# EAGLE design mainBoard (EAGLE 7.6.0)
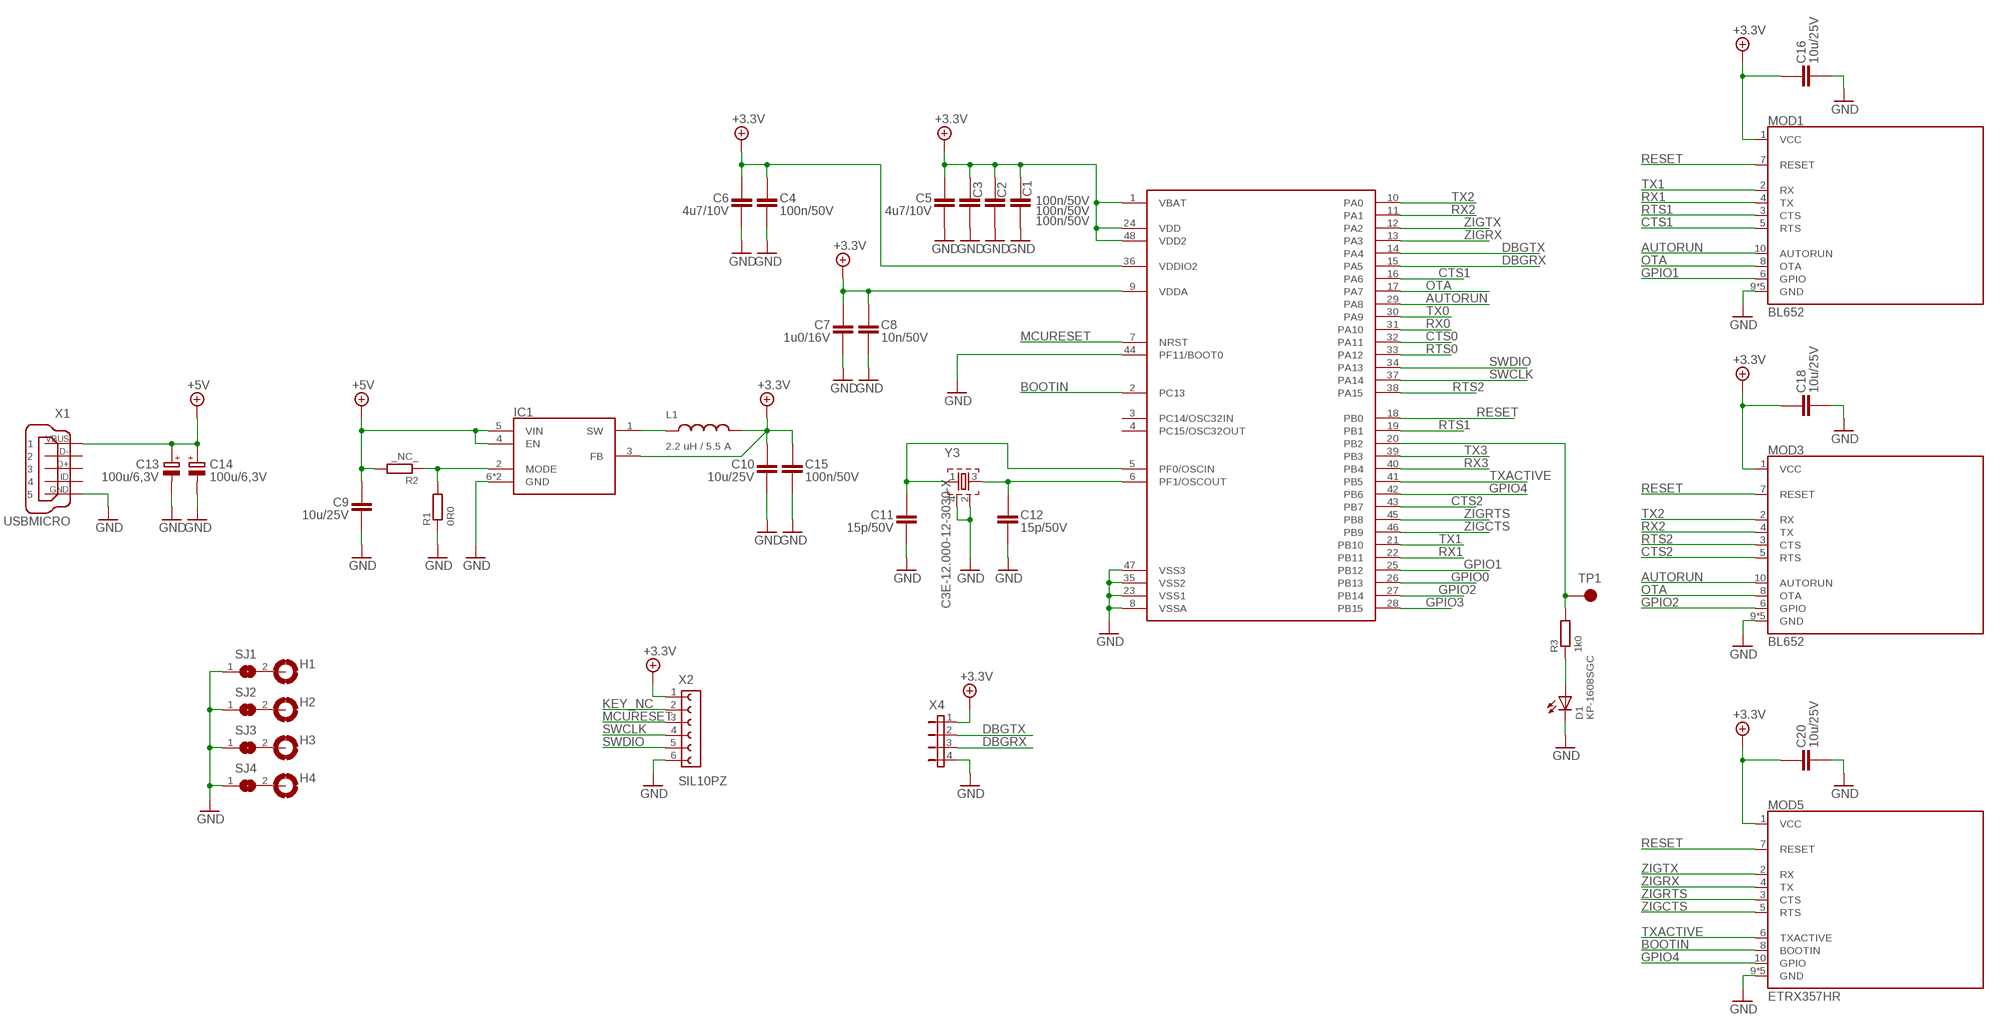
[diagram p0: schematic, sheet 1, part 1 of 2]
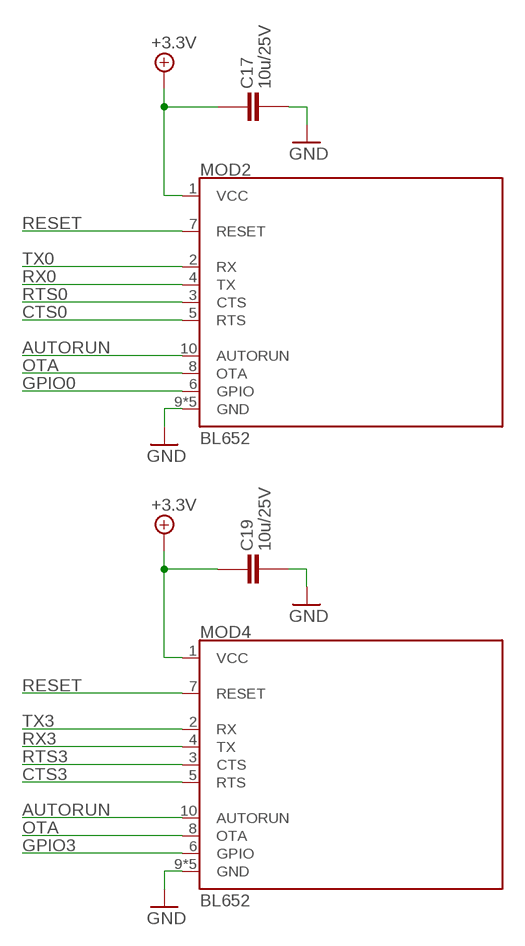
[diagram p1: schematic, sheet 1, part 2 of 2]

## Parts
C1  100N/50V,X7R,+/-10%_0603R  [C0603R]
C2  100N/50V,X7R,+/-10%_0603R  [C0603R]
C3  100N/50V,X7R,+/-10%_0603R  [C0603R]
C4  100N/50V,X7R,+/-10%_0603R  [C0603R]
C5  4U7/10V,X5R,+/-10%_0603R  [C0603R]
C6  4U7/10V,X5R,+/-10%_0603R  [C0603R]
C7  1U0/16V,X5R,+/-10%_0603R  [C0603R]
C8  10N/50V,X7R,+/-10%_0603R  [C0603R]
C9  10U/25V,X5R,+/-10%_0805R  [C0805R]
C10  10U/25V,X5R,+/-10%_0805R  [C0805R]
C11  15P/50V,COG/NPO,+/-5%_0603R  [C0603R]
C12  15P/50V,COG/NPO,+/-5%_0603R  [C0603R]
C13  100U  [CT6032]
C14  100U  [CT6032]
C15  100N/50V,X7R,+/-10%_0603R  [C0603R]
C16  10U/25V,X5R,+/-10%_0805R  [C0805R]
C17  10U/25V,X5R,+/-10%_0805R  [C0805R]
C18  10U/25V,X5R,+/-10%_0805R  [C0805R]
C19  10U/25V,X5R,+/-10%_0805R  [C0805R]
C20  10U/25V,X5R,+/-10%_0805R  [C0805R]
D1  KP-1608SGC  [0603]
H1  MOUNT-PAD-ROUND4.3  [4.3-PAD]
H2  MOUNT-PAD-ROUND4.3  [4.3-PAD]
H3  MOUNT-PAD-ROUND4.3  [4.3-PAD]
H4  MOUNT-PAD-ROUND4.3  [4.3-PAD]
IC0  STM32F091CCT  [LQFP48]
IC1  TPS62291  [TPS62291]
L1  2U2_IHLP2020  [5.49X2X5.18MM]
MOD1  BLEMODULE  [BLEMOD]
MOD2  BLEMODULE  [BLEMOD]
MOD3  BLEMODULE  [BLEMOD]
MOD4  BLEMODULE  [BLEMOD]
MOD5  ZIGBEE  [ZIGBEEMOD]
R1  0R0/0.1W,THICK_FILM,1%_0603R  [R0603R]
R2  _NC_/0.1W,THICK_FILM,1%_0603R  [R0603R]
R3  1K0/0.1W,THICK_FILM,1%_0603R  [R0603R]
SJ1  SJ_1-SMALL  [SJ-SMALL]
SJ2  SJ_1-SMALL  [SJ-SMALL]
SJ3  SJ_1-SMALL  [SJ-SMALL]
SJ4  SJ_1-SMALL  [SJ-SMALL]
TP1  TEST-PAD_3.5X2-SMD  [3.5X2_SMD]
X1  USBMICRO  [USBMICRO]
X2  SOCKET_HADER-1X6  [1X06]
X4  PIN_HEADER-1X4  [1X04]
Y3  C3E-12.000-12-3030-X  [3.4X2.7X0.75]

## Nets
+3.3V: C1.2 C2.2 C3.2 C4.2 C5.2 C6.2 C7.2 C8.2 C10.2 C15.2 C16.2 C17.2 C18.2 C19.2 C20.2 IC0.1(VBAT) IC0.9(VDDA) IC0.24(VDD) IC0.36(VDDIO2) IC0.48(VDD2) IC1.3(FB) L1.P$2 MOD1.1(VCC) MOD2.1(VCC) MOD3.1(VCC) MOD4.1(VCC) MOD5.1(VCC) X2.1 X4.1
+5V: C9.2 C13.+ C14.+ IC1.4(EN) IC1.5(VIN) R2.2 X1.1
AUTORUN: IC0.29(PA8) MOD1.10(AUTORUN) MOD2.10(AUTORUN) MOD3.10(AUTORUN) MOD4.10(AUTORUN)
BOOTIN: IC0.2(PC13) MOD5.8(BOOTIN)
CTS0: IC0.32(PA11) MOD2.5(RTS)
CTS1: IC0.16(PA6) MOD1.5(RTS)
CTS2: IC0.43(PB7) MOD3.5(RTS)
CTS3: MOD4.5(RTS)
DBGRX: IC0.15(PA5) X4.3
DBGTX: IC0.14(PA4) X4.2
GND: C1.1 C2.1 C3.1 C4.1 C5.1 C6.1 C7.1 C8.1 C9.1 C10.1 C11.1 C12.1 C13.- C14.- C15.1 C16.1 C17.1 C18.1 C19.1 C20.1 D1.2(C) IC0.8(VSSA) IC0.23(VSS1) IC0.35(VSS2) IC0.44(PF11/BOOT0) IC0.47(VSS3) IC1.6(GND) IC1.EXP(GND) MOD1.9(GND) MOD1.A1(GND) MOD1.A2(GND) MOD1.B1(GND) MOD1.B2(GND) MOD2.9(GND) MOD2.A1(GND) MOD2.A2(GND) MOD2.B1(GND) MOD2.B2(GND) MOD3.9(GND) MOD3.A1(GND) MOD3.A2(GND) MOD3.B1(GND) MOD3.B2(GND) MOD4.9(GND) MOD4.A1(GND) MOD4.A2(GND) MOD4.B1(GND) MOD4.B2(GND) MOD5.9(GND) MOD5.A1(GND) MOD5.A2(GND) MOD5.B1(GND) MOD5.B2(GND) R1.1 SJ1.1 SJ2.1 SJ3.1 SJ4.1 X1.5 X1.H1 X1.H2 X2.6 X4.4 Y3.2 Y3.4
GPIO0: IC0.26(PB13) MOD2.6(GPIO)
GPIO1: IC0.25(PB12) MOD1.6(GPIO)
GPIO2: IC0.27(PB14) MOD3.6(GPIO)
GPIO3: IC0.28(PB15) MOD4.6(GPIO)
GPIO4: IC0.42(PB6) MOD5.10(GPIO)
KEY_NC: X2.2
MCURESET: IC0.7(NRST) X2.3
N$1: IC1.1(SW) L1.P$1
N$2: D1.1(A) R3.1
N$3: IC0.20(PB2) R3.2 TP1.TP
N$4: IC1.2(MODE) R1.2 R2.1
N$5: H1.1(MOUNT) SJ1.2
N$6: H2.1(MOUNT) SJ2.2
N$7: H3.1(MOUNT) SJ3.2
N$8: H4.1(MOUNT) SJ4.2
N$34: C11.2 IC0.5(PF0/OSCIN) Y3.1
N$35: C12.2 IC0.6(PF1/OSCOUT) Y3.3
OTA: IC0.17(PA7) MOD1.8(OTA) MOD2.8(OTA) MOD3.8(OTA) MOD4.8(OTA)
RESET: IC0.18(PB0) MOD1.7(RESET) MOD2.7(RESET) MOD3.7(RESET) MOD4.7(RESET) MOD5.7(RESET)
RTS0: IC0.33(PA12) MOD2.3(CTS)
RTS1: IC0.19(PB1) MOD1.3(CTS)
RTS2: IC0.38(PA15) MOD3.3(CTS)
RTS3: MOD4.3(CTS)
RX0: IC0.31(PA10) MOD2.4(TX)
RX1: IC0.22(PB11) MOD1.4(TX)
RX2: IC0.11(PA1) MOD3.4(TX)
RX3: IC0.40(PB4) MOD4.4(TX)
SWCLK: IC0.37(PA14) X2.4
SWDIO: IC0.34(PA13) X2.5
TX0: IC0.30(PA9) MOD2.2(RX)
TX1: IC0.21(PB10) MOD1.2(RX)
TX2: IC0.10(PA0) MOD3.2(RX)
TX3: IC0.39(PB3) MOD4.2(RX)
TXACTIVE: IC0.41(PB5) MOD5.6(TXACTIVE)
ZIGCTS: IC0.46(PB9) MOD5.5(RTS)
ZIGRTS: IC0.45(PB8) MOD5.3(CTS)
ZIGRX: IC0.13(PA3) MOD5.4(TX)
ZIGTX: IC0.12(PA2) MOD5.2(RX)
Unconnected: IC0.3(PC14/OSC32IN) IC0.4(PC15/OSC32OUT) X1.2 X1.3 X1.4

## Library data of the parts
C1-C4 C15 = 0-LIB_Capacitor_ceramic:100N; COMPONENT_PACKAGE: 0603; COMPONENT_TITLE: Capacitor ceramic; COMPONENT_VALUE: 100n/50V; LIB: ECAP-000019; LIB_REEL: ECAP-000129; NOTE: X7R, +/-10%
C5 C6 = 0-LIB_Capacitor_ceramic:4U7; COMPONENT_PACKAGE: 0603; COMPONENT_TITLE: Capacitor ceramic; COMPONENT_VALUE: 4u7/10V; LIB: ECAP-000044; NOTE: X5R, +/-10%
C7 = 0-LIB_Capacitor_ceramic:1U0; COMPONENT_PACKAGE: 0603; COMPONENT_TITLE: Capacitor ceramic; COMPONENT_VALUE: 1u0/16V; LIB: ECAP-000027; NOTE: X5R, +/-10%
C8 = 0-LIB_Capacitor_ceramic:10N; COMPONENT_PACKAGE: 0603; COMPONENT_TITLE: Capacitor ceramic; COMPONENT_VALUE: 10n/50V; LIB: ECAP-000021; LIB_REEL: ECAP-000127; NOTE: X7R, +/-10%
C9 C10 C16-C20 = 0-LIB_Capacitor_ceramic:10U; COMPONENT_PACKAGE: 0805; COMPONENT_TITLE: Capacitor ceramic; COMPONENT_VALUE: 10u/25V; LIB: ECAP-000112; LIB_REEL: ECAP-000143; NOTE: X5R, +/-10%
C11 C12 = 0-LIB_Capacitor_ceramic:15P; COMPONENT_PACKAGE: 0603; COMPONENT_TITLE: Capacitor ceramic; COMPONENT_VALUE: 15p/50V; LIB: ECAP-000023; NOTE: COG/NPO, +/-5%
C13 C14 = 0-LIB_Capacitor_tantalum:100U; COMPONENT_MANUFACTURER: Kemet; COMPONENT_PACKAGE: 6032 metric, C; COMPONENT_TITLE: Capacitor Tantalum; COMPONENT_VALUE: 100u/6,3V; LIB: ECAP-000236; NOTE: LOW ESR
D1 = 0-LIB_LED:KP-1608?; COMPONENT_MANUFACTURER: Kingbright; COMPONENT_PACKAGE: 0603; COMPONENT_TITLE: LED Diode; COMPONENT_VALUE: KP-1608SGC; FARNELL: 8529833; LIB: ELED-000003; NOTE: Green
H1-H4 = 0-LIB_Accesories_PCB:MOUNT-PAD-ROUND: MOUNTING PAD, round; DISPLAY_DEVICE: NO
IC0 = lib:STM32F091CCT
IC1 = lib:TPS62291
L1 = 0-LIB_Inductor:2U2; COMPONENT_MANUFACTURER: Vishay/Dale; COMPONENT_PACKAGE: 5,49x2x5,18mm; COMPONENT_TITLE: Inductor; COMPONENT_VALUE: 2.2 uH / 5.5 A; LIB: EIND-000039; NOTE: IHLP2020BZER2R2M11
MOD1-MOD4 = boards:BLEMODULE; COMPONENT_VALUE: BL652
MOD5 = boards:ZIGBEE; COMPONENT_VALUE: ETRX357HR
R1 = 0-LIB_Resistor:0R0; COMPONENT_PACKAGE: 0603; COMPONENT_TITLE: Resistor; COMPONENT_VALUE: 0R0; LIB: ERES-000024; LIB_REEL: ERES-000194; NOTE: 0.1W, Thick_Film, 1%
R2 = 0-LIB_Resistor:_NC_; COMPONENT_PACKAGE: 0603; COMPONENT_TITLE: Resistor; COMPONENT_VALUE: _NC_; DISPLAY_DEVICE: NO; NOTE: 0.1W, Thick_Film, 1%
R3 = 0-LIB_Resistor:1K0; COMPONENT_PACKAGE: 0603; COMPONENT_TITLE: Resistor; COMPONENT_VALUE: 1k0; LIB: ERES-000036; LIB_REEL: ERES-000200; NOTE: 0.1W, Thick_Film, 1%
SJ1-SJ4 = 0-LIB_Accesories_PCB:SJ_1?; DISPLAY_DEVICE: NO
TP1 = 0-LIB_Accesories_PCB:TEST-PAD; DISPLAY_DEVICE: NO
X1 = lib:USBMICRO
X2 = 0-LIB_Connectors_Board-to-Board:SOCKET_HADER-1X6; COMPONENT_MANUFACTURER: XINYA; COMPONENT_PACKAGE: 2.54mm; 1x6sockets; COMPONENT_TITLE: Connector - Socket Header; COMPONENT_VALUE: SIL10PZ; GMD: 824-019; LIB: ECON-000012
X4 = 0-LIB_Connectors_Board-to-Board:PIN_HEADER-1X4; COMPONENT_PACKAGE: 2.54mm; 1x4pins; COMPONENT_TITLE: Connector - Pin Header; LIB: ECON-000376
Y3 = 0-LIB_Crystal:C3E-12.000-12-3030-X; COMPONENT_MANUFACTURER: AKER; COMPONENT_PACKAGE: 3.4 x 2.7mm; COMPONENT_TITLE: Crystal; COMPONENT_VALUE: C3E-12.000-12-3030-X; FARNELL: 1538852; LIB: EOSC-000011; NOTE: 12Mhz

## Board
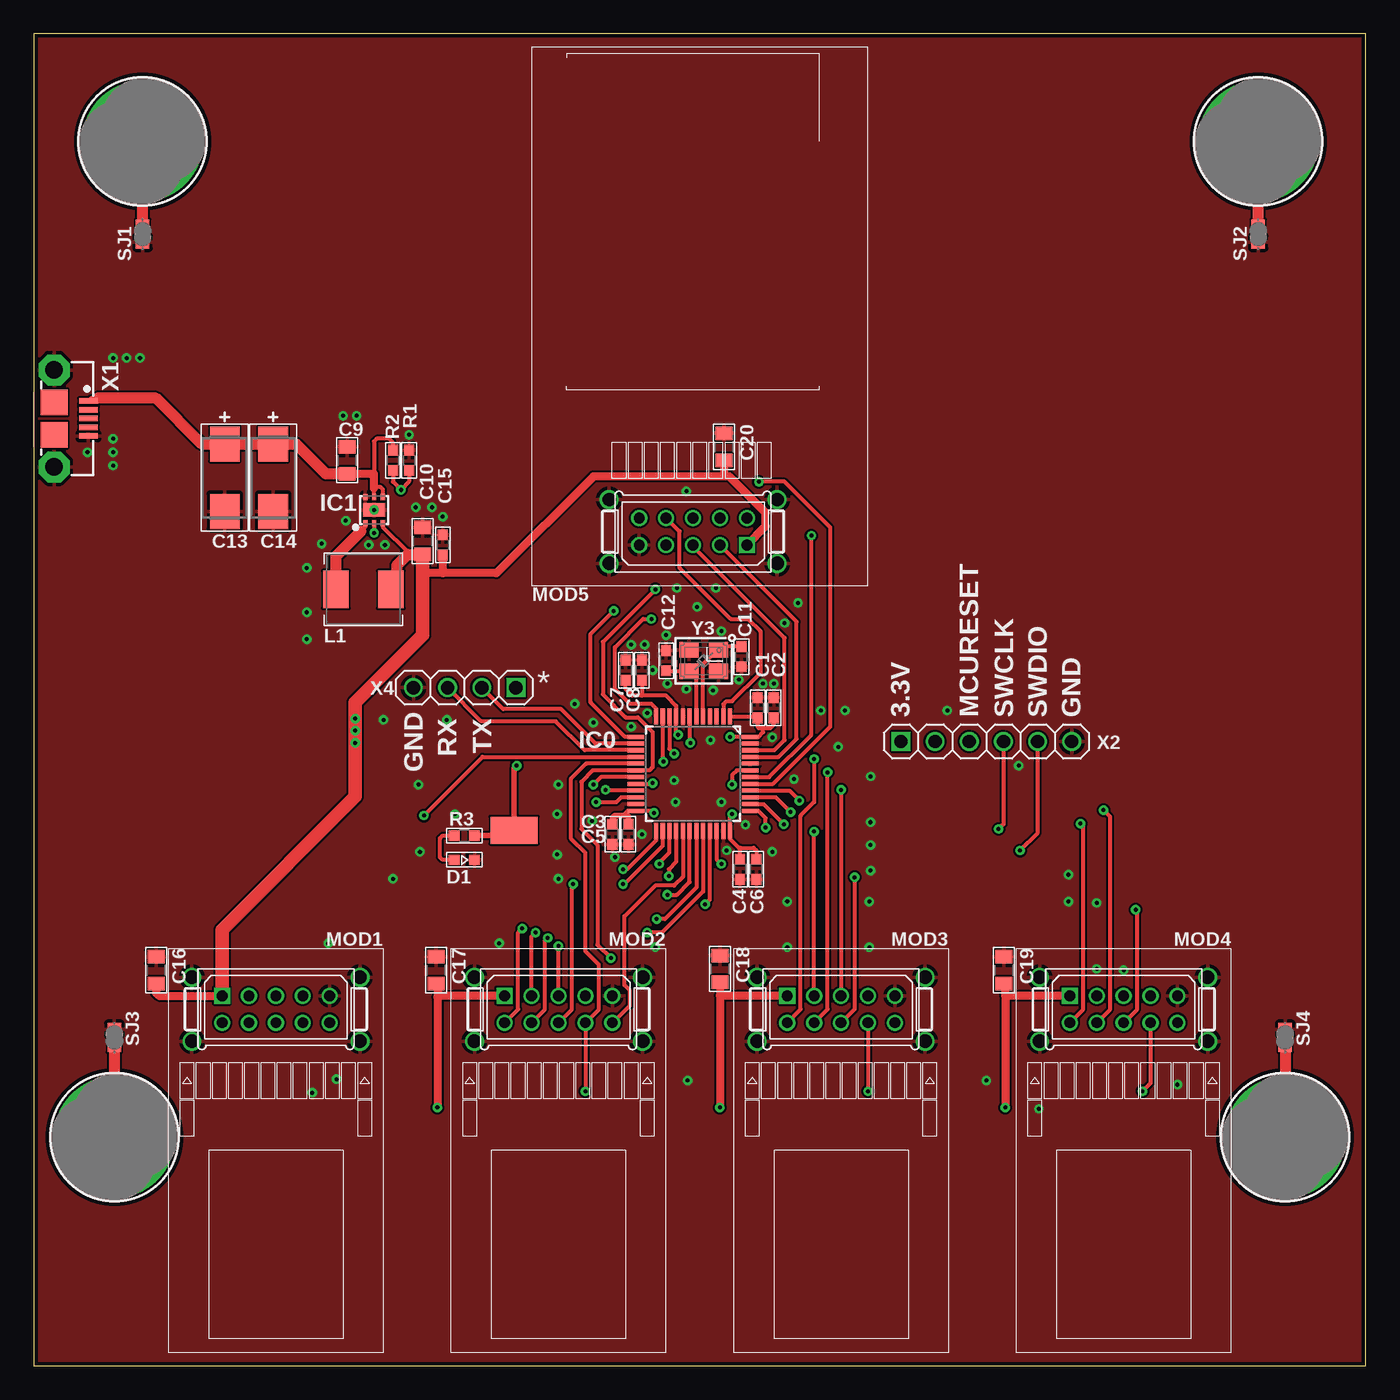
[diagram p2: board, top side]
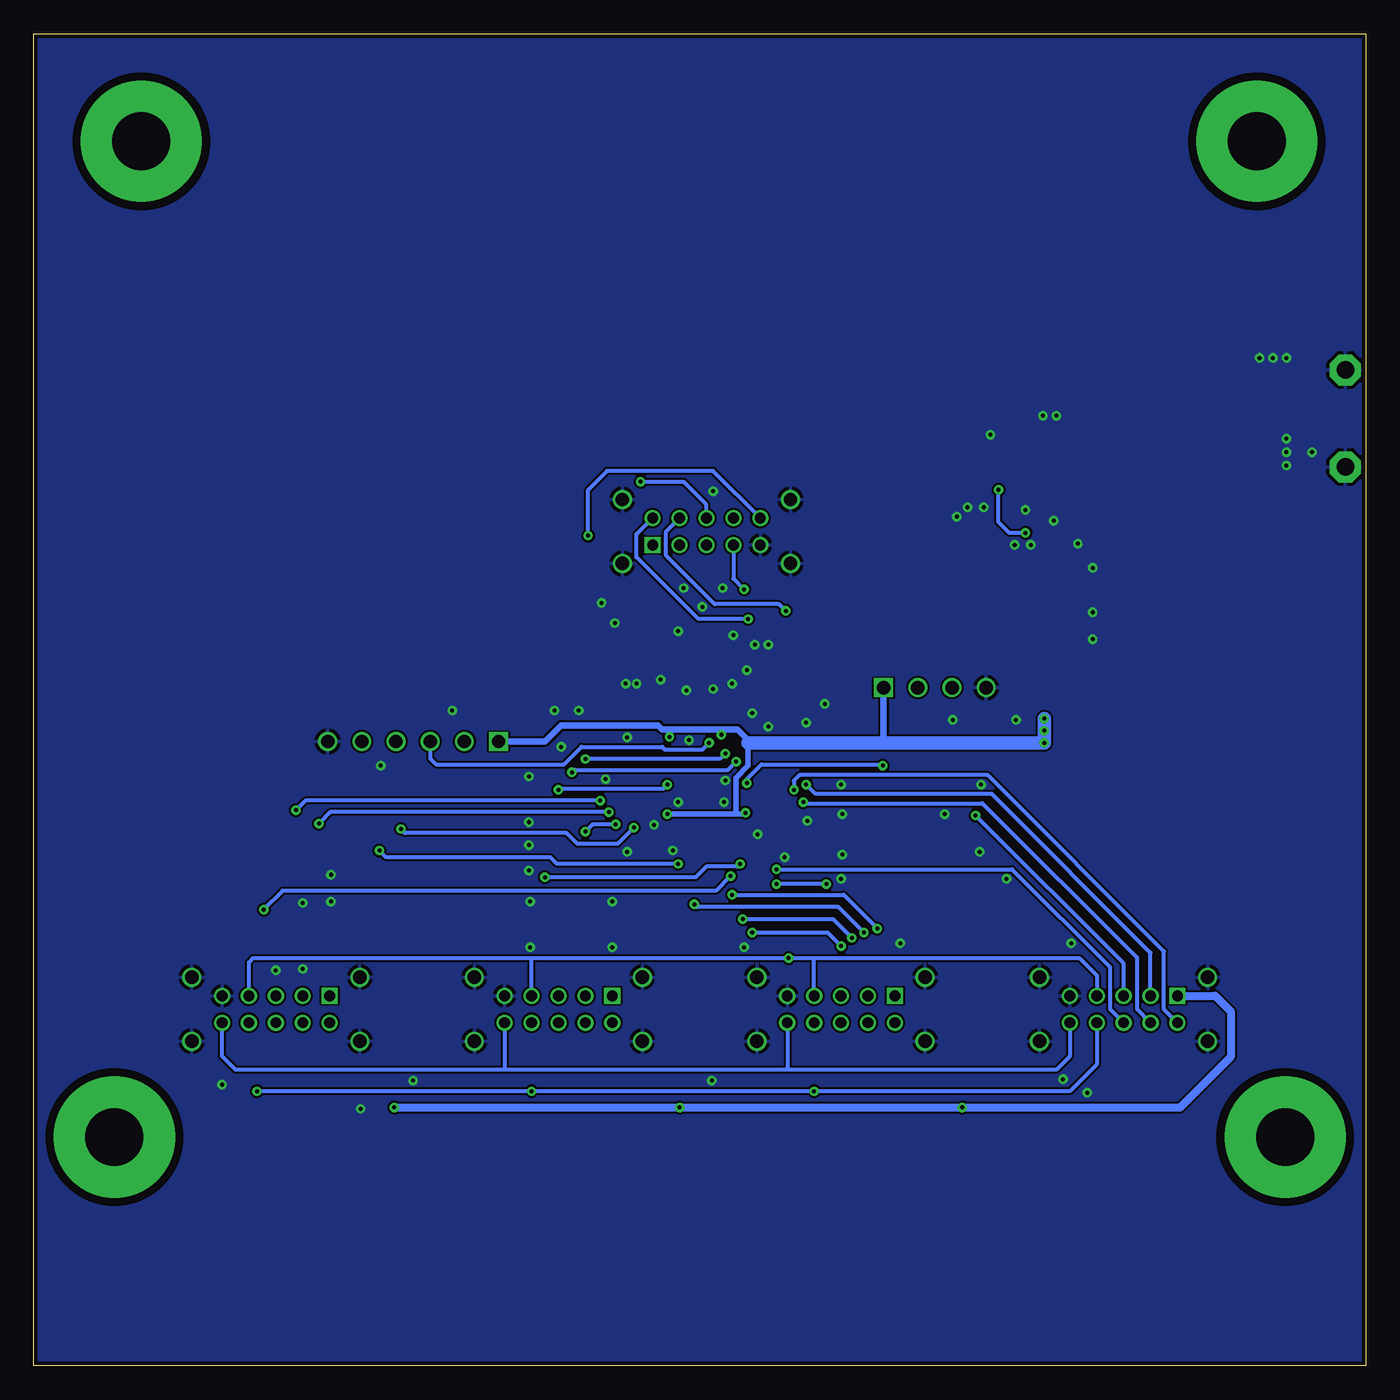
[diagram p3: board, bottom side, seen from below]

Size 99 x 99 mm. Coordinates in mm from the lower left corner, seen from the top.
Outline: 0,0 99,0 99,99 0,99 0,0
Copper layers (1+2*15+16): Top 0.018mm / dielectric 0.25mm / Route2 0.018mm / dielectric 0.4mm / Route15 0.018mm / dielectric 0.25mm / Bottom 0.018mm
Design rules "KC6benesov": minimum track width 0.15mm, minimum drill 0.3mm, track to track 0.15mm, track to pad 0.15mm, pad to pad 0.15mm, via to via 0.15mm, smd to smd 0.15mm, copper to edge 0.3mm, drill to drill 0.3mm, minimum pad ring 0.2mm, minimum via ring 0.2mm, stop-mask expansion 0mil, vias tented up to drill 0.4mm, thermal gap 10mil

### Footprints (pad centres in the part's own frame; a part is rotated, then mirrored left to right if it is on the bottom)
C0603R = smd 0.8 x 0.75: 1 -0.75,0; 2 0.75,0
C0805R = smd 1 x 1.25: 1 -1,0; 2 1,0
CT6032 = smd 2.6 x 2.2: + -2.5,0; - 2.5,0
0603 = smd 0.8 x 0.75: 1 -0.75,0; 2 0.75,0
4.3-PAD = drill 4.3 pad 9: 1 0,0
LQFP48 = smd 1.2 x 0.3: 1 -4.25,2.75; 2 -4.25,2.25; 3 -4.25,1.75; 4 -4.25,1.25; 5 -4.25,0.75; 6 -4.25,0.25; 7 -4.25,-0.25; 8 -4.25,-0.75; 9 -4.25,-1.25; 10 -4.25,-1.75; 11 -4.25,-2.25; 12 -4.25,-2.75; 25 4.25,-2.75; 26 4.25,-2.25; 27 4.25,-1.75; 28 4.25,-1.25; 29 4.25,-0.75; 30 4.25,-0.25; 31 4.25,0.25; 32 4.25,0.75; 33 4.25,1.25; 34 4.25,1.75; 35 4.25,2.25; 36 4.25,2.75 | smd 0.3 x 1.2: 13 -2.75,-4.25; 14 -2.25,-4.25; 15 -1.75,-4.25; 16 -1.25,-4.25; 17 -0.75,-4.25; 18 -0.25,-4.25; 19 0.25,-4.25; 20 0.75,-4.25; 21 1.25,-4.25; 22 1.75,-4.25; 23 2.25,-4.25; 24 2.75,-4.25; 37 2.75,4.25; 38 2.25,4.25; 39 1.75,4.25; 40 1.25,4.25; 41 0.75,4.25; 42 0.25,4.25; 43 -0.25,4.25; 44 -0.75,4.25; 45 -1.25,4.25; 46 -1.75,4.25; 47 -2.25,4.25; 48 -2.75,4.25
TPS62291 = smd 0.45 x 0.3: 1 -0.975,0.65; 2 -0.975,0; 3 -0.975,-0.65; 4 0.975,-0.65; 5 0.975,0; 6 0.975,0.65 | smd 1 x 1.6: EXP 0,0
5.49X2X5.18MM = smd 1.915 x 2.79: P$1 -2.038,0; P$2 2.038,0
BLEMOD = drill 0.8 square: 1 4,-11.5 | drill 0.8: 2 4,-9.5; 3 2,-11.5; 4 2,-9.5; 5 0,-11.5; 6 0,-9.5; 7 -2,-11.5; 8 -2,-9.5; 9 -4,-11.5; 10 -4,-9.5 | drill 1: A1 6.24,-12.875; A2 6.24,-8.125; B1 -6.25,-12.875; B2 -6.25,-8.125
ZIGBEEMOD = drill 0.8 square: 1 4,-18 | drill 0.8: 2 4,-16; 3 2,-18; 4 2,-16; 5 0,-18; 6 0,-16; 7 -2,-18; 8 -2,-16; 9 -4,-18; 10 -4,-16 | drill 1: A1 6.25,-19.375; A2 6.25,-14.625; B1 -6.24,-19.375; B2 -6.24,-14.625
R0603R = smd 0.8 x 0.75: 1 -0.75,0; 2 0.75,0
SJ-SMALL = smd 0.95 x 1: 1 -0.603,0; 2 0.603,0
3.5X2_SMD = smd 3.5 x 2: TP 0,0
USBMICRO = smd 0.4 x 1.4: 1 -1.3,1.27; 2 -0.65,1.27; 3 0,1.27; 4 0.65,1.27; 5 1.3,1.27 | drill 1.3 pad 2.3 octagon: H1 -3.6,-1.28; H2 3.6,-1.28 | smd 1.9 x 2: P$6 -1.2,-1.28; P$7 1.2,-1.28
1X06 = drill 1 square: 1 -6.35,0 | drill 1: 2 -3.81,0; 3 -1.27,0; 4 1.27,0; 5 3.81,0; 6 6.35,0
1X04 = drill 1 square: 1 -2.54,0 | drill 1: 2 0,0; 3 2.54,0; 4 5.08,0
3.4X2.7X0.75 = smd 1.4 x 1.15: 1 -1.1,-0.8; 2 1.1,-0.8; 3 1.1,0.8; 4 -1.1,0.8

### Placement (x,y rotation side)
C1  53.8,48.9 270 top
C2  55,48.9 270 top
C3  43,39.5 90 top
C4  52.5,36.9 90 top
C5  44.2,39.5 90 top
C6  53.7,36.9 90 top
C7  44,51.7 270 top
C8  45.2,51.7 270 top
C9  23.3,67.3 270 top
C10  28.9,61.3 270 top
C11  52.6,52.7 90 top
C12  47,52.4 270 top
C13  14.2,66 270 top
C14  17.8,66 270 top
C15  30.4,61 270 top
C16  9.1,29.4 270 top
C17  29.9,29.4 270 top
C18  51,29.5 270 top
C19  72.1,29.4 270 top
C20  51.3,68.3 270 top
D1  32,37.6 0 top
H1  8.1,91 0 top
H2  91,91 0 top
H3  6,17 0 top
H4  93,17 0 top
IC0  49,44 270 top
IC1  25.3,63.6 90 top
L1  24.5,57.7 0 top
MOD1  18,16 180 top
MOD2  39,16 180 top
MOD3  60,16 180 top
MOD4  81,16 180 top
MOD5  49,79 0 top
R1  27.9,67.3 270 top
R2  26.7,67.3 90 top
R3  32,39.4 0 top
SJ1  8.1,84.1 90 top
SJ2  91,84.1 90 top
SJ3  6,24.4 270 top
SJ4  93,24.4 270 top
TP1  35.7,39.8 0 top
X1  2.8,70.4 270 top
X2  70.8,46.4 0 top
X4  33.3,50.4 180 top
Y3  49.8,52.4 180 top

### Tracks (layer width: path | path; a pad name or v marks a point on that pad's centre or on a via)
+3.3V  (via drill 0.3)
  Top 0.3: v46.1,41.1 45.95,41.25 IC0.24 44.15,41.25 43.8,40.9 | v51.75,46.75 IC0.48 53.85,46.75 54.2,47.1 54.2,47.4 | v51.9,41 51.75,40.85 IC0.36 51.75,39.15 52.4,38.5 52.5,38.5 | 55.15,48 C2.2 55,47.65 54.75,47.4 54.2,47.4 | 54.2,47.4 53.9,47.4 53.8,47.5 C1.2 53.8,48.25 IC0.1 | IC1.3 25.95,62.35 27.8,60.5 27.8,60.3 | 52.5,38.5 53.5,38.5 53.7,38.3 C6.2 | C4.2 52.5,38.5 | v47.9,46.9 47.75,47.05 IC0.9 47.75,49.05 47,49.8 45.2,49.8 | 45.2,49.8 44.5,49.8 44,50.3 C7.2 | C8.2 45.2,49.8
  Top 0.4: C3.2 43,40.7 43.2,40.9 43.8,40.9 44.1,40.9 44.2,40.8 C5.2
  Top 0.6: 72.2,27.5 v72.2,19.2 | C18.2 51,27.5 | 51,27.5 v51,19.2 | 30,27.4 30,28.3 C17.2 | 30,27.4 v30,19.2 | MOD3.1 51,27.5 | MOD4.1 72.2,27.5 | MOD2.1 30.1,27.5 30,27.4 | C16.2 9.1,27.7 9.3,27.5 MOD1.1 | C20.2 51.3,66.1 | 72.2,27.5 72.2,28.3 C19.2
  Top 0.61: MOD5.1 54.4,62.4 54.4,63.4 51.7,66.1 51.3,66.1 41.6,66.1 34.4,58.9 30.4,58.9 | 30.4,58.9 28.9,58.9 | C15.2 30.4,58.9
  Top 0.813: L1.P$2 27,58.16 27,59.5 27.8,60.3 C10.2
  Top 1.016: C10.2 28.9,58.9 28.9,54.3 23.9,49.3 v23.9,48.1 v23.9,46.3 23.9,42.3 14,32.4 MOD1.1
  Bottom 0.3: v51.75,46.75 51.8,46.7 | 45.9,46.5 45.9,46.3
  Bottom 0.406: 45.9,46.3 45.9,44.6 46.8,43.7 46.8,41 | 46.8,41 46.2,41 v46.1,41.1 | 46.8,41 v51.9,41
  Bottom 0.5: X2.1 61,46.4 59.8,47.6 52.6,47.6 52.3,47.3 51.8,47.3 | 45.9,46.5 46.7,47.3 47.9,47.3 | 47.9,47.3 51.8,47.3 | v51.75,46.75 51.75,47.25 51.8,47.3 | v47.9,46.9 47.9,47.3 | X4.1 35.84,46.54 35.6,46.3
  Bottom 0.6: v72.2,19.2 v51,19.2 v30,19.2 13.8,19.2 10,23 10,26.3
  Bottom 0.61: MOD1.1 11.2,27.5 10,26.3
  Bottom 1.016: 45.9,46.3 35.6,46.3 v23.9,46.3 v23.9,47.2 v23.9,48.1
+5V
  Top 0.3: IC1.5 25.3,65.2 | 25.3,65.3 25.8,65.3 25.95,65.15 IC1.4 | R2.2 26.7,68.6 26.4,68.9 25.5,68.9 25.3,68.7 25.3,66.3 | 4.7,71.9 4.27,71.9 X1.1
  Top 0.61: C9.2 25.3,66.3 25.3,65.3 25.3,65.2
  Top 0.813: 4.7,71.9 9.1,71.9 12.5,68.5 C13.+ C14.+ 19.5,68.5 21.7,66.3 C9.2
AUTORUN
  Top 0.3: IC0.29 48.25,36.35 47.6,35.7 46.2,35.7 43.9,33.4 43.9,28.3 44.3,27.9 44.3,26.8 MOD2.10
  Bottom 0.3: MOD1.10 22,23 23,22 43,22 | 43,22 64,22 | 64,22 84,22 85,23 MOD4.10 | MOD2.10 43,22 | MOD3.10 64,22
BOOTIN
  Top 0.3: MOD5.8 48,62 48,59.3 51.8,55.5 53.1,55.5 54,54.6 54,51.5 51.9,49.4 51.5,49.4 51.25,49.15 IC0.2
CTS0  (via drill 0.3)
  Top 0.3: MOD2.5 v39,31.2 | v45.6,32.2 46.7,32.2 49.75,35.25 IC0.32
  Bottom 0.3: v45.6,32.2 40,32.2 v39,31.2
CTS1  (via drill 0.3)
  Top 0.3: v29,40.9 33.35,45.25 IC0.16
  Bottom 0.3: MOD1.5 18,29.9 v29,40.9
CTS2  (via drill 0.3)
  Top 0.3: IC0.43 52.25,44.25 51.9,43.9 v51.9,43.2 | v60,42.8 MOD3.5
  Bottom 0.3: v60,42.8 59.9,42.9 52.2,42.9 v51.9,43.2
DBGRX
  Top 0.3: IC0.15 40.95,45.75 38.8,47.9 33.26,47.9 X4.3
DBGTX
  Top 0.3: IC0.14 41.75,46.25 39.2,48.8 34.9,48.8 X4.2
GND  (via drill 0.3)
  other vias: 47.7,41.9 43.2,37.8 45.2,39.5 51.1,41.9 51.5,38.3 54.9,46.7 24.9,61 26.1,61 27.9,69.2 5.9,68.9 4,67.9 5.9,67.9 5.9,66.9 47.1,50.7 47,54.3 50.7,57.8 44.4,47.5 39,43.2 28.6,43.2 39,36.2 26.7,36.2 21.9,31.4 34.6,31.4 56.5,43.6 60.3,48.7 67.9,48.7 56.8,56.7 58.5,48.7 55.8,55.2 54.2,50.7 55,50.7 56,31.1 46.2,31.1 62.1,31.1 62.1,34.5 76.9,34.5 79,34.4 81,29.4 79,29.5 50.3,46.5 23.2,62.8 21.4,61.1 20.3,59.3 20.3,56 20.3,54 22.5,21.3 48.6,21.2 70.8,21.2 20.7,20.3 74.7,19.1 85,20.9 48.5,50.3 50.5,50.2 52.4,51 51.1,54.6 46,51.7 45.4,53.6 44.4,53.6 45.6,48.5 47.8,57.8 49.3,56.4 73.2,44.6 52.9,40.2 56,34.5 59.8,46 41.6,47.8 40.2,49.2 28.4,63.8 29.6,63.8 30.4,63.1 54.9,38.2 28.7,38.2 38.9,38 38.9,41 31.3,41 76.9,36.5 62.2,36.8 62.2,38.7 62.2,40.4 62.2,43.8 48.5,65 24,70.6 23,70.6 5.9,74.9 6.9,74.9 7.9,74.9 25.3,63.6 41.5,40.5 47.6,43.5 30.7,48 26,48
  pour Top: 0,99 99,99 99,0 0,0
  pour Bottom: 0,99 99,99 99,0 0,0
GPIO0  (via drill 0.3)
  Top 0.3: MOD2.6 40,26.5 40,35.7 v40.1,35.8 | IC0.26 46.75,38.65 43.9,35.8 v43.8,35.8
  Bottom 0.3: v40.1,35.8 v43.8,35.8
GPIO1  (via drill 0.3)
  Top 0.3: IC0.25 46.25,39.05 44.1,36.9 v43.8,36.9
  Bottom 0.3: MOD1.6 19,26.5 19,29.6 26.3,36.9 v43.8,36.9
GPIO2  (via drill 0.3)
  Top 0.3: MOD3.6 61,26.5 v61,36.3 | IC0.27 47.25,38.15 46.5,37.4 v46.5,37.3
  Bottom 0.3: v46.5,37.3 46.7,37.1 49,37.1 49.8,36.3 v61,36.3
GPIO3  (via drill 0.3)
  Top 0.3: IC0.28 47.75,37.45 47.2,36.9 v47.2,36.4 | MOD4.6 82,26.5 82,33.8 v81.9,33.9
  Bottom 0.3: 47.3,36.3 v47.2,36.4 48.3,35.3 80.5,35.3 v81.9,33.9
GPIO4  (via drill 0.3)
  Top 0.3: IC0.42 54.65,43.75 57.8,46.9 v57.8,61.7
  Bottom 0.3: MOD5.10 48.5,66.5 56.4,66.5 57.8,65.1 v57.8,61.7
MCURESET  (via drill 0.3)
  Top 0.3: IC0.7 48.75,46.35 v48.8,46.3
  Bottom 0.3: X2.3 69.53,45.13 69.1,44.7 59.6,44.7 58.3,46 52.3,46 52.1,45.8 49.3,45.8 v48.8,46.3
N$1
  Top 0.3: IC1.1 24.65,62.35 24.3,62
  Top 0.813: L1.P$1 22.46,60.16 24.3,62
N$2
  Top 0.3: D1.1 30.4,37.6 30.2,37.8 30.2,39.2 30.4,39.4 R3.1
N$3  (via drill 0.3)
  Top 0.3: IC0.20 45.95,43.25 v46,43.3
  Top 0.406: v35.9,44.6 35.7,44.4 TP1.TP 35.3,39.4 R3.2
  Bottom 0.3: v46,43.3 46,43.6 44.9,44.7 36,44.7 v35.9,44.6
N$4  (via drill 0.3)
  Top 0.3: IC1.2 v25.3,61.9 | R2.1 26.7,65.7 v27.3,65.1 27.9,65.7 R1.2
  Bottom 0.3: v25.3,61.9 26.5,61.9 27.3,62.7 v27.3,65.1
N$5
  Top 0.813: SJ1.2 H1.1
N$6
  Top 0.813: SJ2.2 H2.1
N$7
  Top 0.813: SJ3.2 H3.1
N$8
  Top 0.813: SJ4.2 H4.1
N$34
  Top 0.3: IC0.5 49.75,52.15 50.8,53.2 Y3.1 | 50.95,53.25 Y3.1 | C11.2 51.15,53.45 Y3.1
N$35
  Top 0.3: IC0.6 49.25,51.05 Y3.3 47.05,51.6 C12.2
OTA  (via drill 0.3)
  Top 0.3: MOD4.8 83,21 v82.4,20.4 | MOD3.8 v62,20.4 | v41,20.4 MOD2.8 42,26.5 42,29.8 41,30.8 41,38.1 39.9,39.2 39.9,43.6 41.05,44.75 IC0.17
  Bottom 0.3: MOD1.8 20,22.4 22,20.4 v41,20.4 v62,20.4 v82.4,20.4
RESET  (via drill 0.3)
  Top 0.3: v42.9,30.3 41.9,31.3 41.9,38.7 40.7,39.9 40.7,43.4 41.55,44.25 IC0.18 45.75,44.25 46,44.5 46,47.1 44.9,48.2 44,48.2 42.3,49.9 42.3,53.8 v46.2,57.7
  Bottom 0.3: MOD4.7 83,30 82.7,30.3 62,30.3 | 62,30.3 v42.9,30.3 41,30.3 | 41,30.3 21.3,30.3 20,29 MOD1.7 | MOD2.7 41,30.3 | MOD3.7 62,30.3 | MOD5.7 47,58.5 v46.2,57.7
RTS0  (via drill 0.3)
  Top 0.3: MOD2.3 37,31.9 v37.3,32.2 | v49.9,34.3 50.25,34.65 IC0.33
  Bottom 0.3: v37.3,32.2 39.2,34.1 49.7,34.1 v49.9,34.3
RTS1  (via drill 0.3)
  Top 0.3: IC0.19 42.15,43.75 v41.6,43.2
  Bottom 0.3: MOD1.3 16,30.7 27.8,42.5 40.9,42.5 v41.6,43.2
RTS2  (via drill 0.3)
  Top 0.3: MOD3.3 v58,39.7 | IC0.38 54.25,41.75 v55.75,40.25
  Bottom 0.3: v55.75,40.25 57.45,40.25 v58,39.7
RX0  (via drill 0.3)
  Top 0.3: MOD2.4 38,26.5 38,31.6 v38.2,31.8 | v46.3,33.2 46.9,33.2 49.25,35.55 IC0.31
  Bottom 0.3: v38.2,31.8 39.6,33.2 v46.3,33.2
RX1  (via drill 0.3)
  Top 0.3: IC0.22 43.65,42.25 43.3,41.9 v41.8,41.9
  Bottom 0.3: MOD1.4 17,26.5 17,30.3 28.5,41.8 41.7,41.8 v41.8,41.9
RX2  (via drill 0.3)
  Top 0.3: MOD3.4 59,26.5 v59,44.1 | IC0.11 46.75,44.95 v46.8,44.9
  Bottom 0.3: v59,44.1 58.8,44.3 47.4,44.3 v46.8,44.9
RX3  (via drill 0.3)
  Top 0.3: MOD4.4 80,26.5 80,40.8 v79.5,41.3 | IC0.40 56.15,42.75 v56.9,42
  Bottom 0.3: v79.5,41.3 78.8,42 v56.9,42
SWCLK  (via drill 0.3)
  Top 0.3: X2.4 72.07,40.27 v71.7,39.9 | v54.4,40 54.4,40.7 53.85,41.25 IC0.37
  Bottom 0.3: v54.4,40 55.6,38.8 58.6,38.8 59.4,39.6 71.4,39.6 v71.7,39.9
SWDIO  (via drill 0.3)
  Top 0.3: IC0.34 50.75,37.65 v51.1,37.3 | v73.3,38.3 74.61,39.61 X2.5
  Bottom 0.3: v73.3,38.3 72.8,37.8 60.6,37.8 60.1,37.3 v51.1,37.3
TX0  (via drill 0.3)
  Top 0.3: MOD2.2 36,26.5 36,32.2 v36.3,32.5 | v47.1,35 47.8,35 48.75,35.95 IC0.30
  Bottom 0.3: v47.1,35 38.8,35 v36.3,32.5
TX1  (via drill 0.3)
  Top 0.3: IC0.21 42.55,42.75 v42.5,42.8
  Bottom 0.3: MOD1.2 15,26.5 15,30.8 28.1,43.9 42.1,43.9 42.5,43.5 v42.5,42.8
TX2  (via drill 0.3)
  Top 0.3: MOD3.2 57,26.5 57,40.9 58,41.9 v58,45.1 | IC0.10 47.25,45.85 v47.6,45.5
  Bottom 0.3: v47.6,45.5 48,45.1 v58,45.1
TX3  (via drill 0.3)
  Top 0.3: MOD4.2 78,26.5 78,40.1 v77.8,40.3 | IC0.39 55.15,42.25 v56.25,41.15
  Bottom 0.3: v56.25,41.15 76.95,41.15 v77.8,40.3
TXACTIVE  (via drill 0.3)
  Top 0.3: IC0.41 54.95,43.25 59.2,47.5 59.2,62.3 55.8,65.7 v53.9,65.7
  Bottom 0.3: MOD5.6 49,64 50.7,65.7 v53.9,65.7
ZIGCTS
  Top 0.3: IC0.46 55.05,45.75 55.8,46.5 55.8,54.1 49,60.9 MOD5.5
ZIGRTS
  Top 0.3: IC0.45 55.35,45.25 56.7,46.6 56.7,55.3 MOD5.3
ZIGRX  (via drill 0.3)
  Top 0.3: IC0.13 43.95,46.75 41.4,49.3 41.4,54.4 v43.1,56.1
  Bottom 0.3: v43.1,56.1 43.6,56.6 48.4,56.6 52,60.2 52,62 MOD5.4
ZIGTX  (via drill 0.3)
  Top 0.3: IC0.12 46.25,48.85 45.9,49.2 44.3,49.2 43.2,50.3 43.2,53.4 45.3,55.5 v45.9,55.5
  Bottom 0.3: v45.9,55.5 49.6,55.5 54.2,60.1 54.2,61.8 MOD5.2

### Text on the board
tPlace: GND | RX | TX | 3.3V | MCURESET | SWCLK | SWDIO | GND